# EAGLE schematic SparkFun_Pro_Micro_v13a (EAGLE 6.5.0)

## Sheet 1 of 5
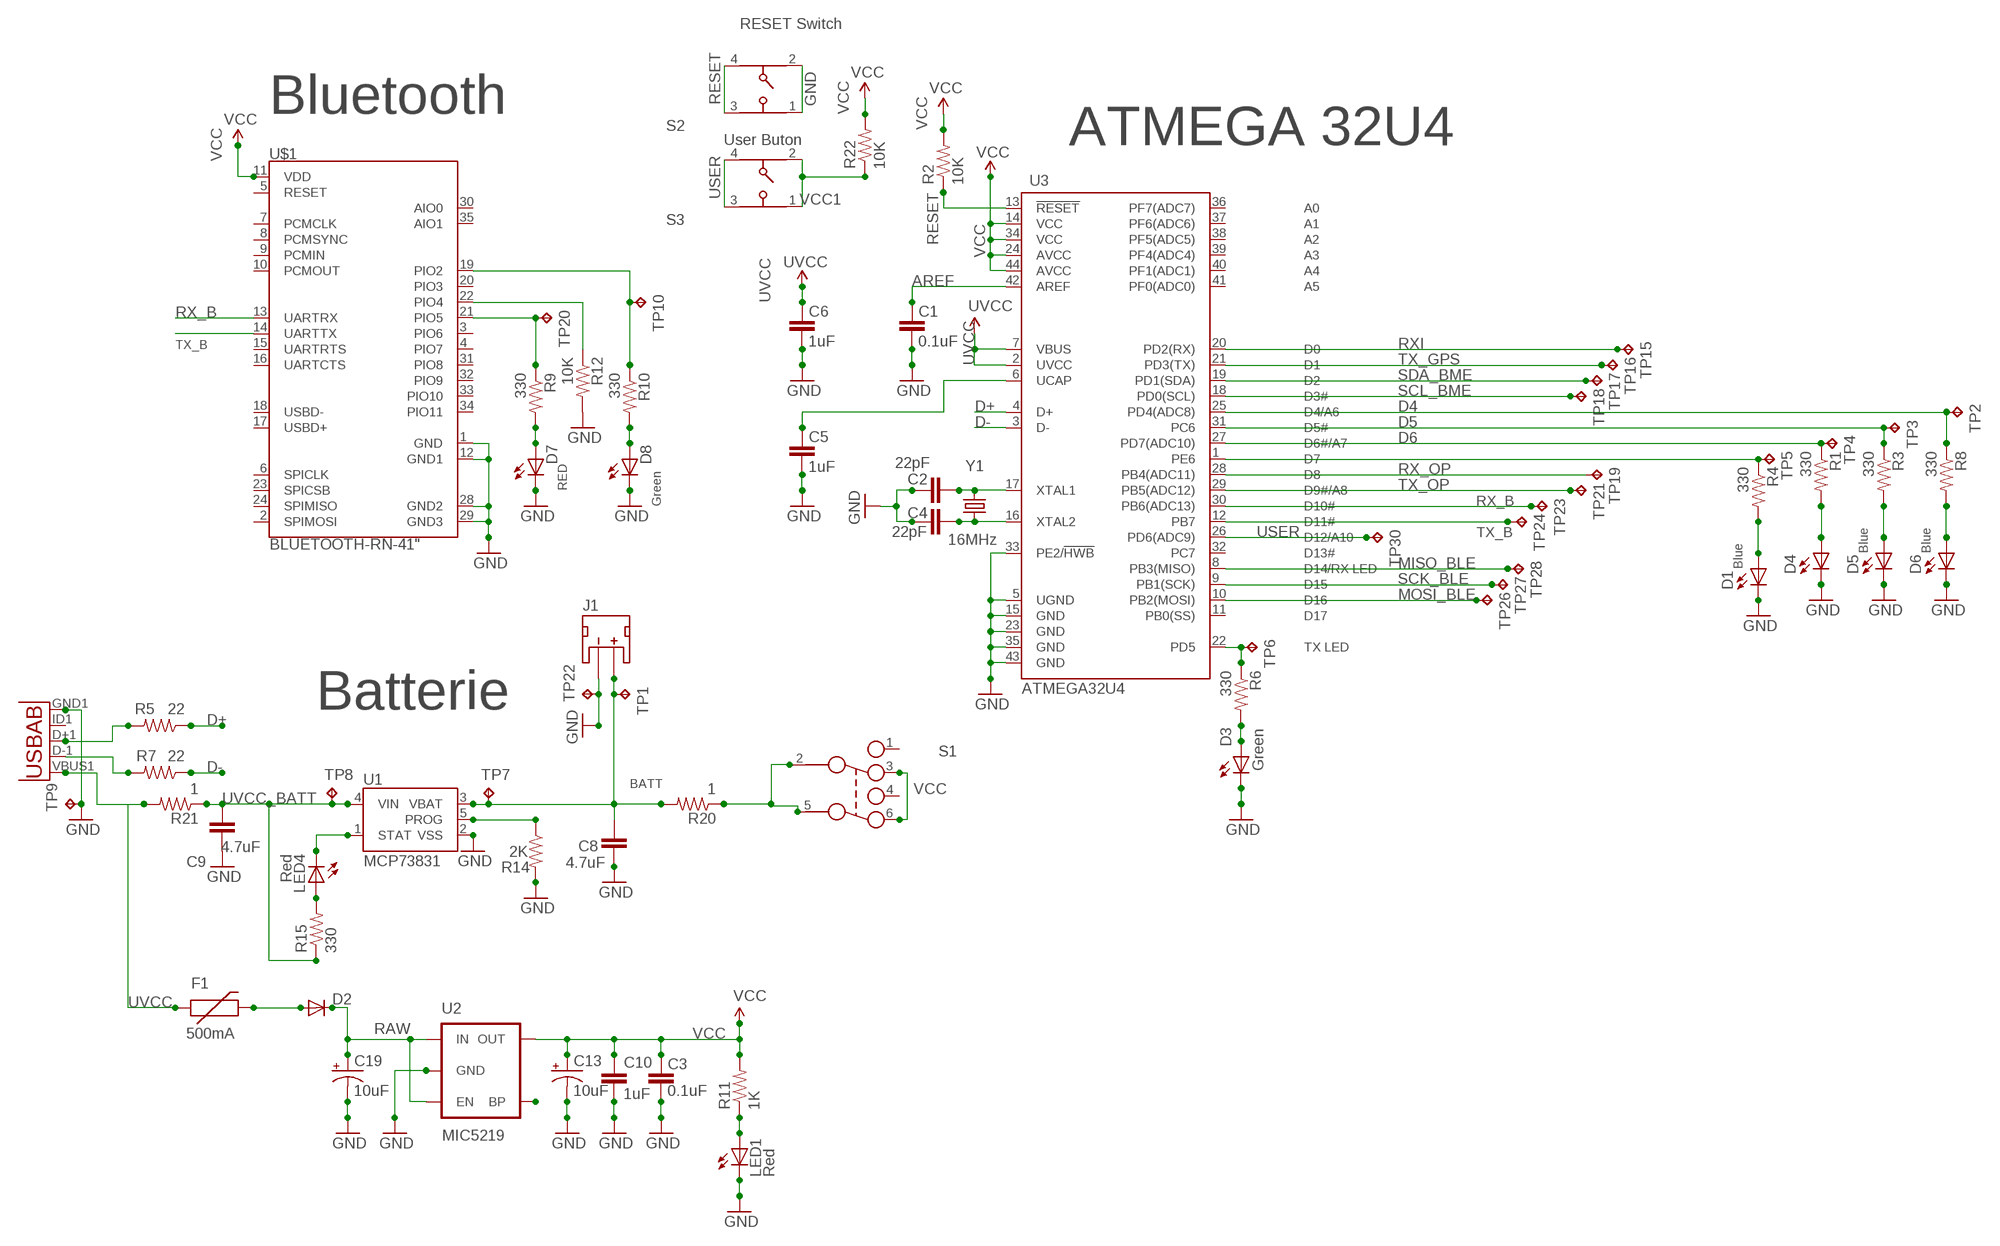
[diagram p0: schematic, sheet 1]

### Parts
C1  0.1uF  CAP0603-CAP  [0603-CAP]
C2  22pF  CAP0603-CAP  [0603-CAP]
C3  0.1uF  CAP0603-CAP  [0603-CAP]
C4  22pF  CAP0603-CAP  [0603-CAP]
C5  1uF  CAP0603-CAP  [0603-CAP]
C6  1uF  CAP0603-CAP  [0603-CAP]
C8  4.7uF  CAP0603-CAP  [0603-CAP]
C9  4.7uF  CAP0603-CAP  [0603-CAP]
C10  1uF  CAP0603-CAP  [0603-CAP]
C13  10uF  CAP_POL1206  [EIA3216]
C19  10uF  CAP_POL1206  [EIA3216]
D1  Yellow  LED0603  [LED-0603]
D2  DIODESOD  [SOD-323]
D3  Green  LED0603  [LED-0603]
D4  Yellow  LED0603  [LED-0603]
D5  Yellow  LED0603  [LED-0603]
D6  Yellow  LED0603  [LED-0603]
D7  Yellow  LED0603  [LED-0603]
D8  Yellow  LED0603  [LED-0603]
F1  500mA  PTCSMD  [PTC-1206]
J1  JST_2MM_MALE  [JST-2-SMD]
LED1  Red  LED0603  [LED-0603]
LED4  Red  LED0603  [LED-0603]
R1  330  RESISTOR0603-RES  [0603-RES]
R2  10K  RESISTOR0603-RES  [0603-RES]
R3  330  RESISTOR0603-RES  [0603-RES]
R4  330  RESISTOR0603-RES  [0603-RES]
R5  22  RESISTOR0603-RES  [0603-RES]
R6  330  RESISTOR0603-RES  [0603-RES]
R7  22  RESISTOR0603-RES  [0603-RES]
R8  330  RESISTOR0603-RES  [0603-RES]
R9  330  RESISTOR0603-RES  [0603-RES]
R10  330  RESISTOR0603-RES  [0603-RES]
R11  1K  RESISTOR0603-RES  [0603-RES]
R12  10K  RESISTOR0603-RES  [0603-RES]
R14  2K  RESISTOR0603-RES  [0603-RES]
R15  330  RESISTOR0603-RES  [0603-RES]
R20  1  RESISTOR0603-RES  [0603-RES]
R21  1  RESISTOR0603-RES  [0603-RES]
R22  10K  RESISTOR0603-RES  [0603-RES]
S1  452403012014  [452403012014]
S2  434153017835  [434153017835]
S3  434153017835  [434153017835]
TP1  TPTP08SQ  [TP08SQ]
TP2  TPTP08SQ  [TP08SQ]
TP3  TPTP08SQ  [TP08SQ]
TP4  TPTP08SQ  [TP08SQ]
TP5  TPTP08SQ  [TP08SQ]
TP6  TPTP08SQ  [TP08SQ]
TP7  TPTP08SQ  [TP08SQ]
TP8  TPTP08SQ  [TP08SQ]
TP9  TPTP17SQ  [TP17SQ]
TP10  TPTP08SQ  [TP08SQ]
TP15  TPTP08SQ  [TP08SQ]
TP16  TPTP08SQ  [TP08SQ]
TP17  TPTP08SQ  [TP08SQ]
TP18  TPTP08SQ  [TP08SQ]
TP19  TPTP08SQ  [TP08SQ]
TP20  TPTP08SQ  [TP08SQ]
TP21  TPTP08SQ  [TP08SQ]
TP22  TPTP08SQ  [TP08SQ]
TP23  TPTP20SQ  [TP20SQ]
TP24  TPTP20SQ  [TP20SQ]
TP26  TPTP08SQ  [TP08SQ]
TP27  TPTP08SQ  [TP08SQ]
TP28  TPTP08SQ  [TP08SQ]
TP30  TPTP08SQ  [TP08SQ]
U1  MCP73831  [SOT23-5]
U2  MIC5219  V_REG_LDOSMD  [SOT23-5]
U3  ATMEGA32U4  ATMEGA32U4OUTFAKES  [QFN-44-NOPAD_1:1-OUTFAKES]
U$1  BLUETOOTH-RN-41"  [RN41]
X1  USB-ABIN&OUT  [USB-AB-MICRO-SMD-V03-IN&OUT]
Y1  16MHz  CRYSTAL5X3  [CRYSTAL-SMD-5X3]

### Nets
AREF: C1.2 U3.42(AREF)
D1: R9.1 TP20.TP U$1.21(PIO5)
D2: R10.1 TP10.TP U$1.19(PIO2)
D4: R8.1 TP2.TP U3.25(PD4(ADC8))
D5: R3.1 TP3.TP U3.31(PC6)
D6: R1.1 TP4.TP U3.27(PD7(ADC10))
D14: R4.1 TP5.TP U3.1(PE6)
D+: R5.1 U3.4(D+)
D-: R7.1 U3.3(D-)
GND: C1.1 C2.2 C3.1 C4.2 C5.1 C6.1 C8.2 C9.2 C10.2 C13.C(-) C19.C(-) D1.C D3.C D4.C D5.C D6.C D7.C D8.C J1.1(-) LED1.C R12.2 R14.2 S2.1 S2.2 TP9.TP TP22.TP U1.2(VSS) U2.2(GND) U3.5(UGND) U3.15(GND) U3.23(GND) U3.33(PE2/!HWB) U3.35(GND) U3.43(GND) U$1.1(GND) U$1.12(GND1) U$1.28(GND2) U$1.29(GND3) X1.GND1(GND) ; also sheet 2,3,4,5
MISO_BLE: TP28.TP U3.8(PB3(MISO)) ; also sheet 3
MOSI_BLE: TP26.TP U3.10(PB2(MOSI)) ; also sheet 3
N$1: C4.1 U3.16(XTAL2) Y1.1
N$2: C2.1 U3.17(XTAL1) Y1.3
N$3: D2.2(A) F1.2
N$4: C5.2 U3.6(UCAP)
N$5: D1.A R4.2
N$6: R7.2 X1.D-1(D-)
N$7: D4.A R1.2
N$8: R5.2 X1.D+1(D+)
N$9: D5.A R3.2
N$10: D6.A R8.2
N$11: D3.A R6.2
N$12: R12.1 U$1.22(PIO4)
N$13: D7.A R9.2
N$14: D8.A R10.2
N$18: R14.1 U1.5(PROG)
N$19: LED4.A R15.2
N$20: LED4.C U1.1(STAT)
N$23: U2.4(BP)
N$38: LED1.A R11.1
N$70: R20.1 S1.2 S1.5
RAW [vcc]: C19.A(+) D2.1(C) U2.1(IN) U2.3(EN)
RESET: R2.1 S2.3 S2.4 U3.13(!RESET)
RX_B: TP23.TP U3.30(PB6(ADC13)) U$1.13(UARTRX)
RX_OP: TP19.TP U3.28(PB4(ADC11)) ; also sheet 5
RXI: TP15.TP U3.20(PD2(RX)) ; also sheet 5
SCK_BLE: TP27.TP U3.9(PB1(SCK)) ; also sheet 3
SCL_BME: TP18.TP U3.18(PD0(SCL)) ; also sheet 2
SDA_BME: TP17.TP U3.19(PD1(SDA)) ; also sheet 2
TX_B: TP24.TP U3.12(PB7) U$1.14(UARTTX)
TX_GPS: TP16.TP U3.21(PD3(TX)) ; also sheet 4
TX_OP: TP21.TP U3.29(PB5(ADC12)) ; also sheet 5
TXLED: R6.1 TP6.TP U3.22(PD5)
USER: S3.3 S3.4 TP30.TP U3.26(PD6(ADC9))
UVCC: C6.2 F1.1 R21.2 U3.2(UVCC) U3.7(VBUS) X1.VBUS1(VBUS)
UVCC_BATT: C9.1 R15.1 R21.1 TP8.TP U1.4(VIN)
VBATT: C8.1 J1.2(+) R20.2 TP1.TP TP7.TP U1.3(VBAT)
VCC: C3.2 C10.1 C13.A(+) R2.2 R11.2 R22.2 S1.3 S1.6 U2.5(OUT) U3.14(VCC) U3.24(AVCC) U3.34(VCC) U3.44(AVCC) U$1.11(VDD) ; also sheet 2,3,4,5
VCC1: R22.1 S3.1 S3.2
Unconnected: J1.NC1(PAD1) J1.NC2(PAD2) S1.1 S1.4 U3.11(PB0(SS)) U3.32(PC7) U3.36(PF7(ADC7)) U3.37(PF6(ADC6)) U3.38(PF5(ADC5)) U3.39(PF4(ADC4)) U3.40(PF1(ADC1)) U3.41(PF0(ADC0)) U$1.2(SPIMOSI) U$1.3(PIO6) U$1.4(PIO7) U$1.5(RESET) U$1.6(SPICLK) U$1.7(PCMCLK) U$1.8(PCMSYNC) U$1.9(PCMIN) U$1.10(PCMOUT) U$1.15(UARTRTS) U$1.16(UARTCTS) U$1.17(USBD+) U$1.18(USBD-) U$1.20(PIO3) U$1.23(SPICSB) U$1.24(SPIMISO) U$1.30(AIO0) U$1.31(PIO8) U$1.32(PIO9) U$1.33(PIO10) U$1.34(PIO11) U$1.35(AIO1) X1.ID1(USBID)

### Notes on the sheet
- RESET Switch
- Bluetooth
- User Buton | ATMEGA 32U4
- RED
- Green
- Blue | Blue
- Blue
- Batterie
- BATT

## Sheet 2 of 5
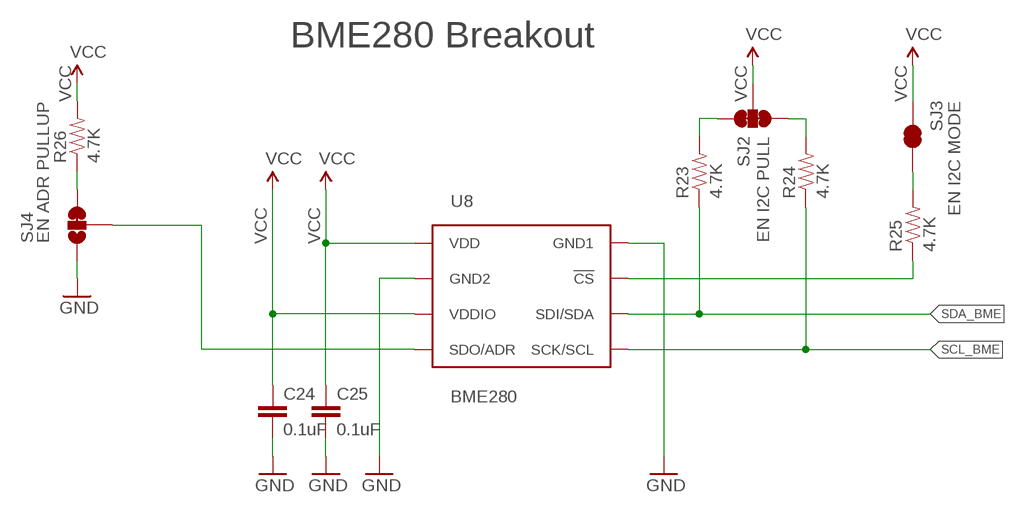
[diagram p1: schematic, sheet 2]

### Parts
C24  0.1uF  0.1UF-25V-5%(0603)  [0603-CAP@2]
C25  0.1uF  0.1UF-25V-5%(0603)  [0603-CAP@2]
R23  4.7K  4.7KOHM-1/10W-1%(0603)  [0603-RES@2]
R24  4.7K  4.7KOHM-1/10W-1%(0603)  [0603-RES@2]
R25  4.7K  4.7KOHM-1/10W-1%(0603)  [0603-RES@2]
R26  4.7K  4.7KOHM-1/10W-1%(0603)  [0603-RES@2]
SJ2  EN I2C PULL  JUMPER-PAD-3-NC_BY_TRACE  [PAD-JUMPER-3-3OF3_NC_BY_TRACE_YES_SILK_FULL_BOX]
SJ3  EN I2C MODE  JUMPER-PAD-2-NC_BY_TRACE  [PAD-JUMPER-2-NC_BY_TRACE_YES_SILK]
SJ4  EN ADR PULLUP  JUMPER-PAD-3-2OF3_NC_BY_TRACE_SMALL  [PAD-JUMPER-3-2OF3_NC_BY_TRACE_YES_SILK_FULL_BOX]
U8  BME280  [BME280_LGA]

### Nets
!CS: R25.1 U8.P$2(!CS)
GND: C24.2 C25.2 SJ4.1 U8.P$1(GND1) U8.P$7(GND2) ; also sheet 1,3,4,5
N$28: R23.2 SJ2.3
N$29: R24.2 SJ2.1
N$30: R25.2 SJ3.1
N$31: R26.1 SJ4.3
SCL_BME: R24.1 U8.P$4(SCK/SCL) ; also sheet 1
SDA_BME: R23.1 U8.P$3(SDI/SDA) ; also sheet 1
SDO/ADR: SJ4.2 U8.P$5(SDO/ADR)
VCC: C24.1 C25.1 R26.2 SJ2.2 SJ3.2 U8.P$6(VDDIO) U8.P$8(VDD) ; also sheet 1,3,4,5

### Notes on the sheet
- BME280 Breakout

## Sheet 3 of 5
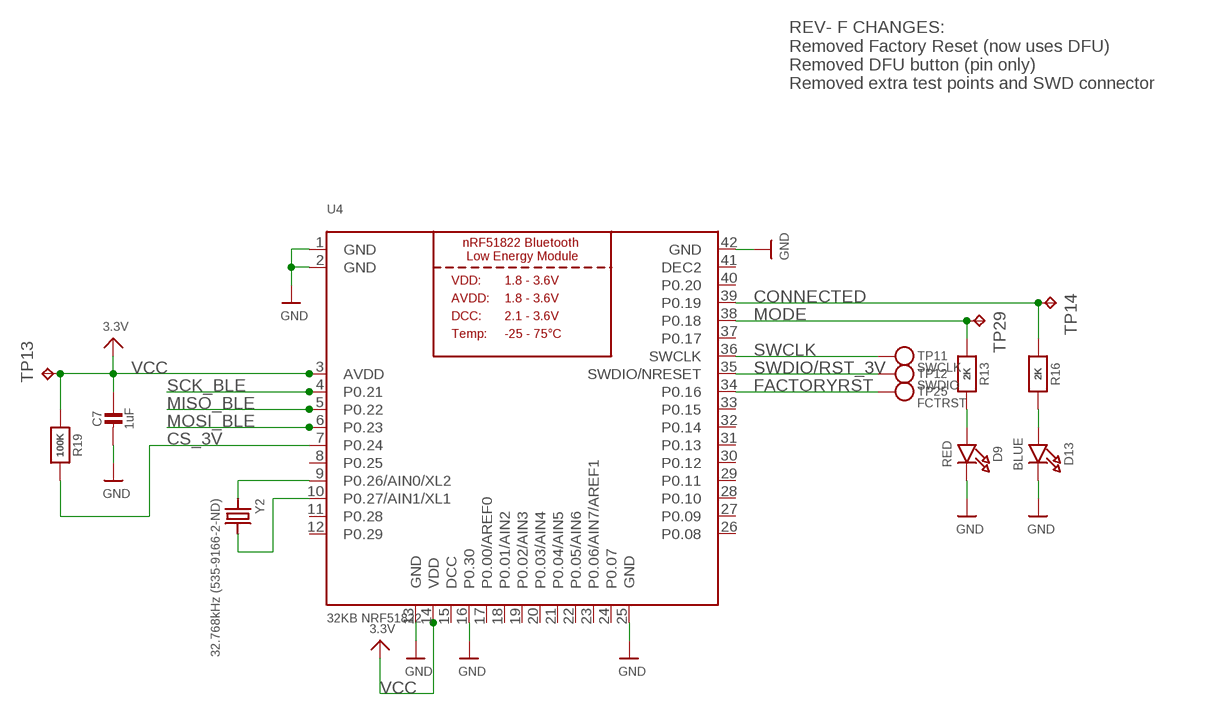
[diagram p2: schematic, sheet 3]

### Parts
C7  1uF  CAP_CERAMIC0805_10MGAP  [0805_10MGAP]
D9  RED  LED0805_NOOUTLINE  [CHIPLED_0805_NOOUTLINE]
D13  BLUE  LED0805_NOOUTLINE  [CHIPLED_0805_NOOUTLINE]
R13  2K  RESISTOR_0805MP  [_0805MP]
R16  2K  RESISTOR_0805MP  [_0805MP]
R19  100K  RESISTOR_0805MP  [_0805MP]
TP11  SWCLK  TESTPOINT1.5X2.0MM_NOCREAM  [PAD-1.5X2.0]
TP12  SWDIO  TESTPOINT1.5X2.0MM_NOCREAM  [PAD-1.5X2.0]
TP13  TPTP08SQ  [TP08SQ]
TP14  TPTP08SQ  [TP08SQ]
TP25  FCTRST  TESTPOINT1.5X2.0MM_NOCREAM  [PAD-1.5X2.0]
TP29  TPTP08SQ  [TP08SQ]
U4  32KB NRF51822  NRF51822_MODULE_MDBT40  [BLE_MODULE_RAYTAC_MDBT40]
Y2  32.768kHz (535-9166-2-ND)  CRYSTAL2.0X6.0_32.768  [CRYSTAL_CYL_2X6MM_SMT]

### Nets
CONNECTED: R16.1 TP14.TP U4.39(P0.19)
CS_3V: R19.2 U4.7(P0.24)
FACTORYRST: TP25.P$1 U4.34(P0.16)
GND: C7.2 D9.C D13.C U4.1(GND) U4.2(GND) U4.13(GND) U4.16(P0.30) U4.25(GND) U4.42(GND) ; also sheet 1,2,4,5
MISO_BLE: U4.5(P0.22) ; also sheet 1
MODE: R13.1 TP29.TP U4.38(P0.18)
MOSI_BLE: U4.6(P0.23) ; also sheet 1
N$15: D9.A R13.2
N$16: D13.A R16.2
N$17: U4.9(P0.26/AIN0/XL2) Y2.1
N$21: U4.10(P0.27/AIN1/XL1) Y2.2
SCK_BLE: U4.4(P0.21) ; also sheet 1
SWCLK: TP11.P$1 U4.36(SWCLK)
SWDIO/RST_3V: TP12.P$1 U4.35(SWDIO/NRESET)
VCC: C7.1 R19.1 TP13.TP U4.3(AVDD) U4.14(VDD) ; supply symbol labelled 3.3V ; also sheet 1,2,4,5
Unconnected: U4.8(P0.25) U4.11(P0.28) U4.12(P0.29) U4.17(P0.00/AREF0) U4.18(P0.01/AIN2) U4.19(P0.02/AIN3) U4.20(P0.03/AIN4) U4.21(P0.04/AIN5) U4.22(P0.05/AIN6) U4.23(P0.06/AIN7/AREF1) U4.24(P0.07) U4.26(P0.08) U4.27(P0.09) U4.28(P0.10) U4.29(P0.11) U4.30(P0.12) U4.31(P0.13) U4.32(P0.14) U4.33(P0.15) U4.37(P0.17) U4.40(P0.20)

### Notes on the sheet
- REV- F CHANGES:
  Removed Factory Reset (now uses DFU)
  Removed DFU button (pin only)
  Removed extra test points and SWD connector

## Sheet 4 of 5
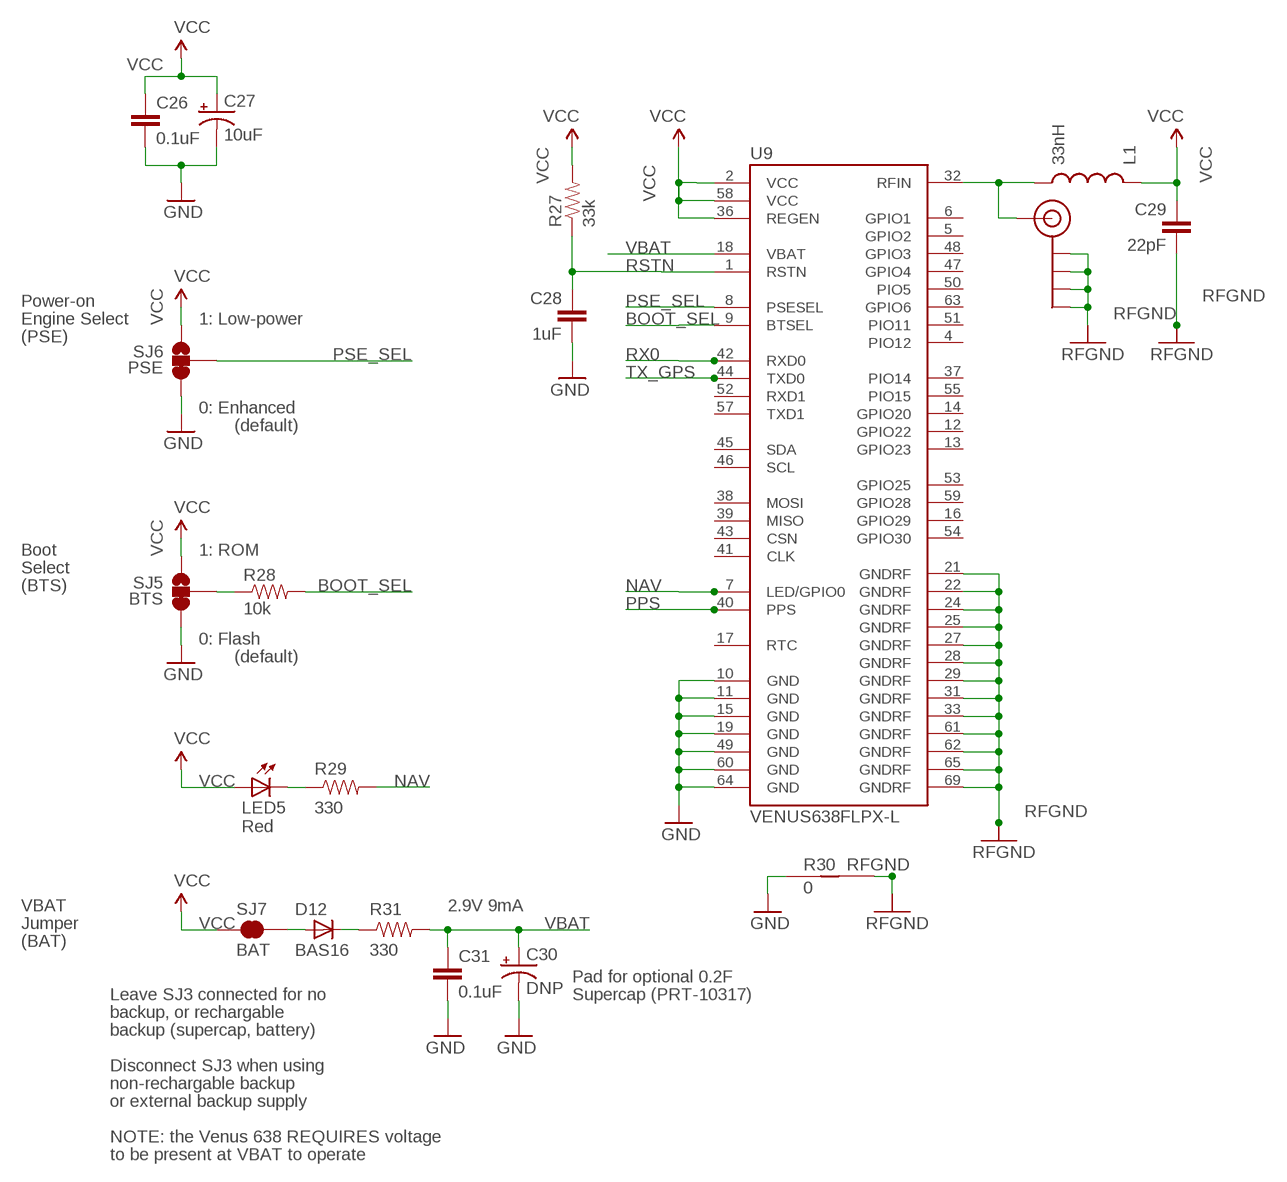
[diagram p3: schematic, sheet 4]

### Parts
C26  0.1uF  CAP0402-CAP  [0402-CAP]
C27  10uF  CAP_POL1206  [EIA3216]
C28  1uF  CAP0402-CAP  [0402-CAP]
C29  22pF  CAP0402-CAP  [0402-CAP]
C30  DNP  CAP_POLEN_J2  [EN_J2]
C31  0.1uF  CAP0402-CAP  [0402-CAP]
D12  BAS16  DIODESOD  [SOD-323]
JP10  SMA_EDGE  [SMA-EDGE]
L1  33nH  INDUCTOR0402  [C0402]
LED5  Red  LED0603  [LED-0603]
R27  33k  RESISTOR0402-RES  [0402-RES]
R28  10k  RESISTOR0402-RES  [0402-RES]
R29  330  RESISTOR0402-RES  [0402-RES]
R30  0  GND-JUMP  [GND-JUMP]
R31  330  RESISTOR0402-RES  [0402-RES]
SJ5  BTS  SOLDERJUMPER_2WAYPASTE2&3  [SJ_3_PASTE2&3]
SJ6  PSE  SOLDERJUMPER_2WAYPASTE2&3  [SJ_3_PASTE2&3]
SJ7  BAT  SOLDERJUMPERNC  [SJ_2S]
U9  VENUS638FLPX-L  [VENUS638FLPX]

### Nets
ANT: JP10.SIG(SIGNAL) L1.2 U9.32(RFIN)
BOOT_SEL: R28.2 U9.9(BTSEL)
GND: C26.2 C27.C(-) C28.2 C30.- C31.2 R30.1 SJ5.3 SJ6.3 U9.10(GND) U9.11(GND) U9.15(GND) U9.19(GND) U9.49(GND) U9.60(GND) U9.64(GND) ; also sheet 1,2,3,5
N$34: LED5.C R29.1
N$35: R28.1 SJ5.2
N$36: D12.2(A) SJ7.2
N$37: D12.1(C) R31.1
NAV: R29.2 U9.7(LED/GPIO0)
PPS: U9.40(PPS)
PSE_SEL: SJ6.2 U9.8(PSESEL)
RFGND: C29.2 JP10.GND@0(GND) JP10.GND@1(GND) JP10.GND@2(GND) JP10.GND@3(GND) R30.2 U9.21(GNDRF) U9.22(GNDRF) U9.24(GNDRF) U9.25(GNDRF) U9.27(GNDRF) U9.28(GNDRF) U9.29(GNDRF) U9.31(GNDRF) U9.33(GNDRF) U9.61(GNDRF) U9.62(GNDRF) U9.65(GNDRF) U9.69(GNDRF)
RSTN: C28.1 R27.1 U9.1(RSTN)
RX0: U9.42(RXD0)
TX_GPS: U9.44(TXD0) ; also sheet 1
VBAT: C30.+ C31.1 R31.2 U9.18(VBAT)
VCC: C26.1 C27.A(+) C29.1 L1.1 LED5.A R27.2 SJ5.1 SJ6.1 SJ7.1 U9.2(VCC) U9.36(REGEN) U9.58(VCC) ; also sheet 1,2,3,5
Unconnected: U9.4(PIO12) U9.5(GPIO2) U9.6(GPIO1) U9.12(GPIO22) U9.13(GPIO23) U9.14(GPIO20) U9.16(GPIO29) U9.17(RTC) U9.37(PIO14) U9.38(MOSI) U9.39(MISO) U9.41(CLK) U9.43(CSN) U9.45(SDA) U9.46(SCL) U9.47(GPIO4) U9.48(GPIO3) U9.50(PIO5) U9.51(PIO11) U9.52(RXD1) U9.53(GPIO25) U9.54(GPIO30) U9.55(PIO15) U9.57(TXD1) U9.59(GPIO28) U9.63(GPIO6)

### Notes on the sheet
- Power-on
- Engine Select | 1: Low-power
- (PSE)
- RFGND | RFGND
- 0: Enhanced
- (default)
- Boot | 1: ROM
- Select
- (BTS)
- 0: Flash
- (default)
- RFGND
- VBAT | 2.9V 9mA
- Jumper | RFGND
- (BAT)
- Pad for optional 0.2F
- Leave SJ3 connected for no | Supercap (PRT-10317)
- backup, or rechargable
- backup (supercap, battery)
- Disconnect SJ3 when using
- non-rechargable backup
- or external backup supply
- NOTE: the Venus 638 REQUIRES voltage
- to be present at VBAT to operate

## Sheet 5 of 5
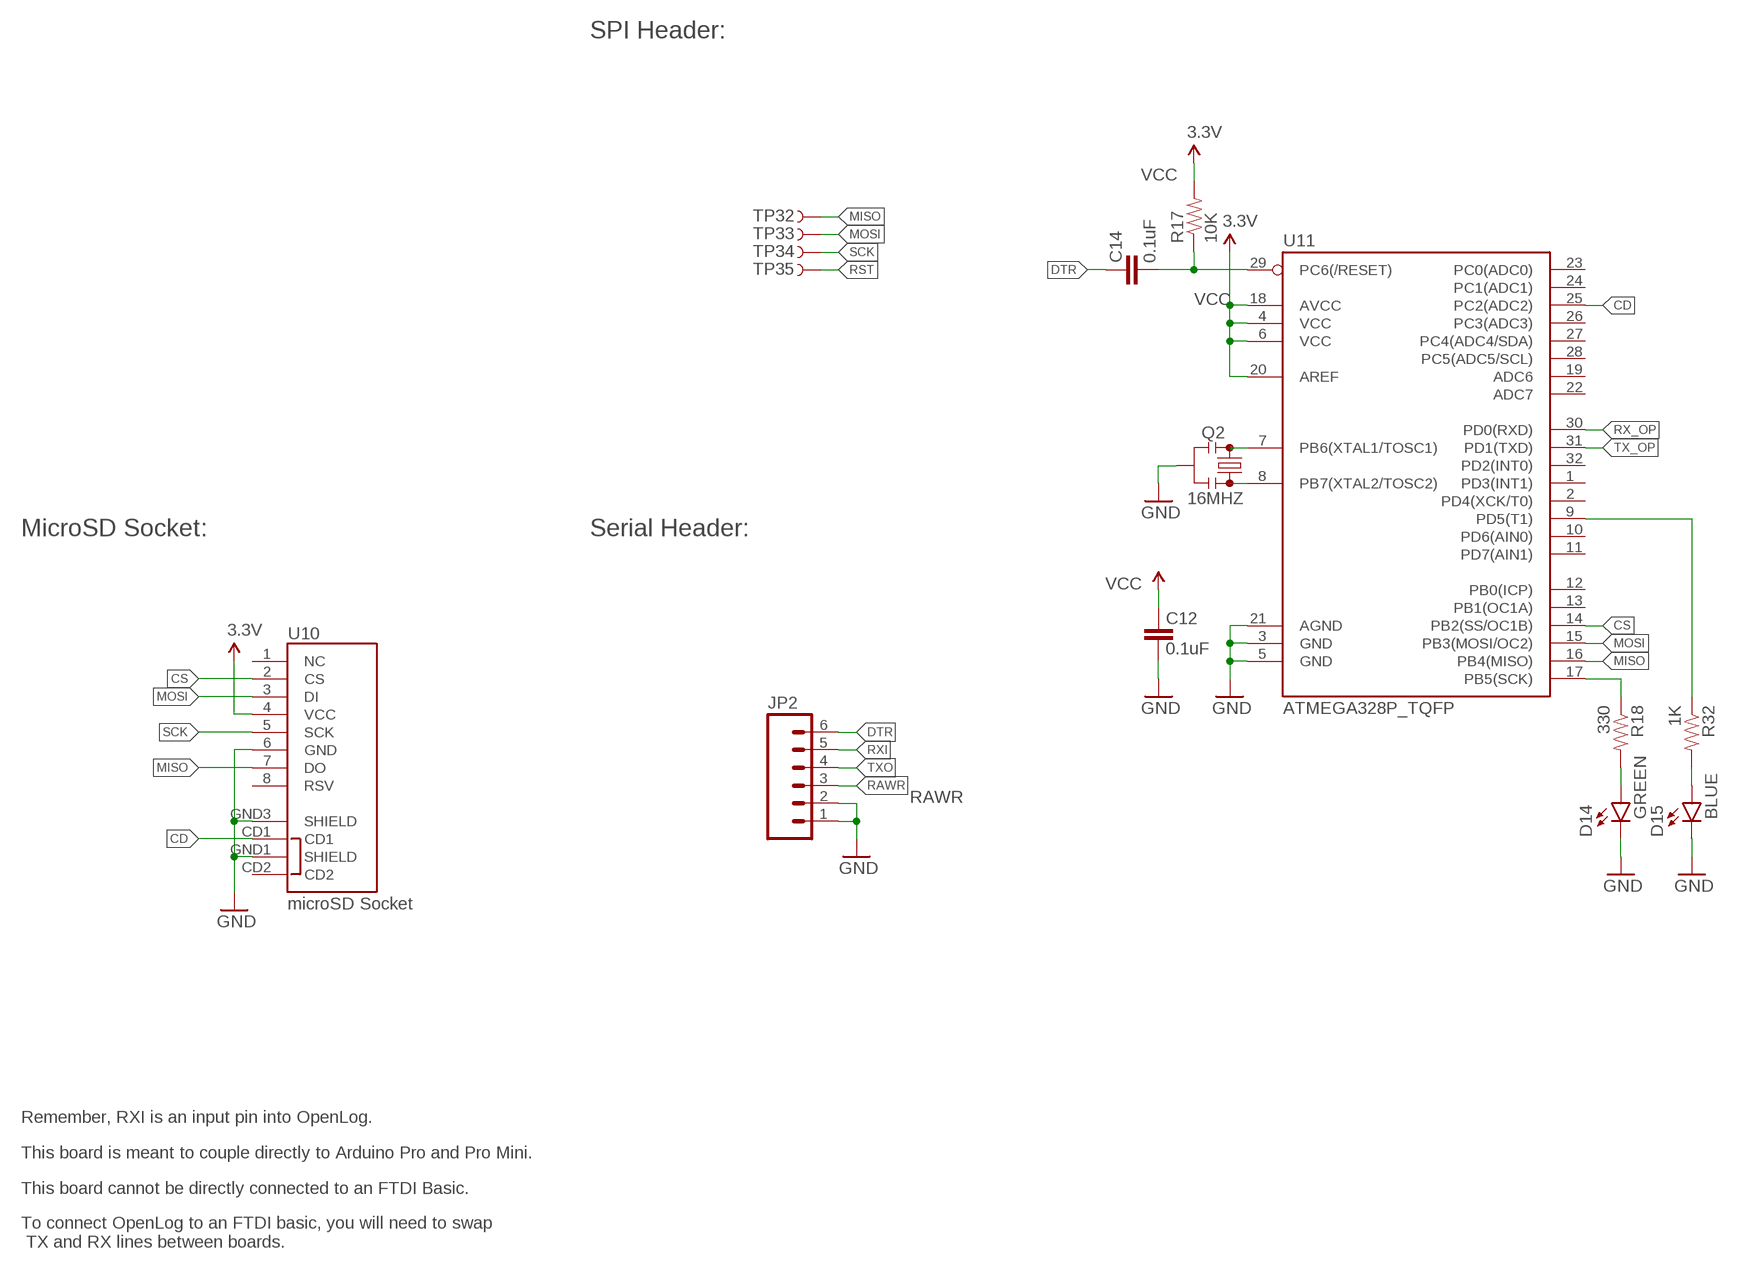
[diagram p4: schematic, sheet 5]

### Parts
C12  0.1uF  0.1UF-25V(+80/-20%)(0603)  [0603-CAP]
C14  0.1uF  0.1UF-25V(+80/-20%)(0603)  [0603-CAP]
D14  GREEN  LED-GREEN0603  [LED-0603]
D15  BLUE  LED-BLUE0603  [LED-0603]
JP2  M06NO_SILK_FEMALE_PTH  [1X06_NO_SILK]
Q2  16MHZ  RESONATOR16MHZ  [RESONATOR-SMD]
R17  10K  10KOHM-1/10W-1%(0603)0603  [0603-RES]
R18  330  330OHM1/10W1%(0603)  [0603-RES]
R32  1K  1KOHM-1/10W-1%(0603)  [0603-RES]
TP32  TEST-POINT3  [PAD.03X.03]
TP33  TEST-POINT3  [PAD.03X.03]
TP34  TEST-POINT3  [PAD.03X.03]
TP35  TEST-POINT3  [PAD.03X.03]
U10  microSD Socket  USD-SOCKET  [MICROSD_1:1]
U11  ATMEGA328P_TQFP  [TQFP32-08]

### Nets
3.3V: U10.4(VCC)
CD: U10.CD1 U11.25(PC2(ADC2))
CS: U10.2(CS) U11.14(PB2(SS/OC1B))
DTR: C14.2 JP2.6
GND: C12.1 D14.C D15.C JP2.1 JP2.2 Q2.2 U10.6(GND) U10.GND1(SHIELD) U10.GND3(SHIELD) U11.3(GND) U11.5(GND) U11.21(AGND) ; also sheet 1,2,3,4
MISO: TP32.P$1 U10.7(DO) U11.16(PB4(MISO))
MOSI: TP33.P$1 U10.3(DI) U11.15(PB3(MOSI/OC2))
N$22: D14.A R18.2
N$32: Q2.1 U11.8(PB7(XTAL2/TOSC2))
N$33: Q2.3 U11.7(PB6(XTAL1/TOSC1))
N$39: D15.A R32.2
N$40: R32.1 U11.9(PD5(T1))
RAWR [vcc]: JP2.3
RST: C14.1 R17.1 TP35.P$1 U11.29(PC6(/RESET))
RX_OP: U11.30(PD0(RXD)) ; also sheet 1
RXI: JP2.5 ; also sheet 1
SCK: R18.1 TP34.P$1 U10.5(SCK) U11.17(PB5(SCK))
TX_OP: U11.31(PD1(TXD)) ; also sheet 1
TXO: JP2.4
VCC: C12.2 R17.2 U11.4(VCC) U11.6(VCC) U11.18(AVCC) U11.20(AREF) ; supply symbol labelled 3.3V ; also sheet 1,2,3,4
Unconnected: U10.1(NC) U10.8(RSV) U10.CD2 U11.1(PD3(INT1)) U11.2(PD4(XCK/T0)) U11.10(PD6(AIN0)) U11.11(PD7(AIN1)) U11.12(PB0(ICP)) U11.13(PB1(OC1A)) U11.19(ADC6) U11.22(ADC7) U11.23(PC0(ADC0)) U11.24(PC1(ADC1)) U11.26(PC3(ADC3)) U11.27(PC4(ADC4/SDA)) U11.28(PC5(ADC5/SCL)) U11.32(PD2(INT0))

### Notes on the sheet
- SPI Header:
- MicroSD Socket: | Serial Header:
- Remember, RXI is an input pin into OpenLog.
- This board is meant to couple directly to Arduino Pro and Pro Mini.
- This board cannot be directly connected to an FTDI Basic.
- To connect OpenLog to an FTDI basic, you will need to swap
   TX and RX lines between boards.

## Power pins joined to a net without a drawn wire
DCC: U4.15(DCC)
DEC2: U4.41(DEC2)

## Library data of the parts
C1-C6 C8-C10 C26 C28 C29 C31 = SparkFun:CAP: Capacitor Standard 0603 ceramic capacitor, and 0.1" leaded capacitor.
C7 = microbuilder:CAP_CERAMIC: Ceramic Capacitors For new designs, use the packages preceded by an '_' character since they are more reliable: The following footprints should be used on most boards: _0402 - Standard footprint for regular board layouts _0603 - Standard footprint for regular board layouts _0805 - Standard footprint for regular board layouts _1206 - Standard footprint for regular board layouts For extremely tight-pitch boards where space is at a premium, the following 'micro-pitch' footprints can be used (smaller pads, no silkscreen outline, etc.): _0402MP - Micro-pitch footprint for very dense/compact boards _0603MP - Micro-pitch footprint for very dense/compact boards _0805MP - Micro-pitch footprint for very dense/compact boards _1206MP - Micro-pitch footprint for very dense/compact boards
C12 C14 = SparkFun-Capacitors:0.1UF-25V(+80/-20%)(0603): CAP-00810 Ceramic Standard decoupling cap; PROD_ID: CAP-00810
C13 C19 C27 C30 = SparkFun:CAP_POL: Capacitor Polarized These are standard SMD and PTH capacitors. Normally 10uF, 47uF, and 100uF in electrolytic and tantalum varieties. Always verify the external diameter of the through hole cap, it varies with capacity, voltage, and manufacturer. The EIA devices should be standard.
C24 C25 = SparkFun-Capacitors:0.1UF-25V-5%(0603): CAP-08604; PROD_ID: CAP-08604
D1 D3-D8 LED1 LED4 LED5 = SparkFun:LED: LEDs Standard schematic elements and footprints for 5mm, 3mm, 1206, and 0603 sized LEDs. 5mm - Spark Fun Electronics SKU : COM-00529 (and others)
D2 D12 = SparkFun:DIODE: Diode These are standard reverse protection diodes and small signal diodes. SMA package can handle up to about 1A. SOD-323 can handle about 200mA. What the SOD-323 package when ordering, there are some mfgs out there that are 5-pin packages.
D9 D13 = microbuilder:LED: LED 0603 - 0603 Surface Mount Package 2mA: Green LED - Low Power (3.9mcd, 2ma, 1.7Vf) - Digikey: 475-2709-2-ND Orange LED - Low Power (9.8mcd, 2ma, 1.8Vf) - Digikey: 475-1194-2-ND Red LED - Low Power (5mcd, 2ma, 1.8Vf) - Digikey: 475-1195-2-ND Yellow LED - Low Power (7mcd, 2ma, 1.8Vf) - Digikey: 475-1196-2-ND 5mA: Blue LED - Low Power (17mcd, 5ma, 2.9Vf) - Digikey: LNJ937W8CRACT-ND 0805 - 0805 Surface Mount Package 2mA: Red LED (8.8mcd, 2mA, 1.8Vf, Clear) - Low Power [Digikey: 475-2510-1-ND] Green LED (5mcd, 2mA, 1.8Vf, Clear) - Low Power [Digikey: 475-2730-1-ND] Yellow LED (11.3mcd, 2mA, 1.8Vf, Clear) - Low Power [Digikey: 475-2555-1-ND] 20mA: Red LED (104mcd, 20mA, Diffused) - LS R976 [Digikey: 475-1278-6-ND] Red LED (12mcd, 20mA, 2.0Vf, Clear) - APT2012EC [Digikey: 754-1128-1-ND] Green LED (15mcd, 20mA, 2.2Vf, Clear) - APT2012GC [Digikey: 754-1131-1-ND] Orange LED (160mcd, 20mA, 2.1Vf, Clear) - APT2012SECK [Digikey: 754-1130-1-ND] 1206 - 1206 Surface Mount Package Green LED (26mcd, 20mA, Diffused) - LG N971 [Digikey: 475-1407-6-ND] Red LED (15mcd, 20mA, Diffused) - LH N974 [Digikey: 475-1416-6-ND] Cree - Cree High-Power Surface Mount LEDs XPEBWT-L1-0000-00D50 - White 111lm 350mA 2.9Vf 6200K 110° XTEAWT-00-0000-00000LEE3 - White 114lm 350mA 2.85Vf 5000K 115° Everlight - Everlight 45-21 Series Surface Mount LEDs 45-21/QK2C-B2832AC2CB2/2T - Warm White 2000mcd 20mA 3.25Vf 3050K 120° 45-21/LK2C-B38452C4CB2/2T - Nuetral White 2000mcd 20mA 3.25Vf 4150K 120° 45-21/LK2C-B50634C6CB2/2T - Cold White 2200mcd 20mA 3.25Vf 5650K 120° PLCC2 Reverse Mount LS T77K-J1L2-1-0-2-R18-Z - Red 11.25mcd 2mA 1.8Vf 630nm 120° LO T77K-L1M2-24-Z - Orange 19.6mcd 2mA 1.8Vf 606nm 120° LY T77K-K2M1-26-Z - Yellow 15.7mcd 2mA 1.8Vf 587nm 120°
D14 = SparkFun-LED:LED-GREEN: Various green LEDs Green LEDs used in SFE Production 0603- DIO-00821 LARGE- DIO-00862 LILYPAD- DIO-09910; PROD_ID: DIO-00821
D15 = SparkFun-LED:LED-BLUE: Blue LEDs for production use Various blue LEDs stocked by SparkFun production 0603 - DIO-08575 Rebel - DIO-09553 1206 - DIO-09911; PROD_ID: DIO-08575
F1 = SparkFun:PTC: Resettable Fuse PTC Resettable Fuse. Spark Fun Electronics SKU : COM-08357
J1 = SparkFun-Connectors:JST_2MM_MALE: JST 2MM MALE RA CONNECTOR Two pin, compact surface mount connector. Commonly used as a battery input connection point. We really like the solid locking feeling and high current rating on these small connectors. We use these all the time as battery connectors. Mates to single-cell LiPo batteries. Here is the connector we sell at SparkFun: JST Right Angle Connector - White <https://www.sparkfun.com/products/8612> (PRT-08612) Datasheet <http://www.sparkfun.com/datasheets/Prototyping/Connectors/JST-Horizontal.pdf> It was used on these SparkFun products: SparkFun MOSFET Power Controller <https://www.sparkfun.com/products/11214> (PRT-11214) SparkFun Battery Babysitter - LiPo Battery Manager <https://www.sparkfun.com/products/13777> (PRT-13777) And many, many others that required a lipo battery connection.; PROD_ID: CONN-11443; SF_ID: PRT-08612
JP2 = SparkFun-Connectors:M06: Header 6 Standard 6-pin 0.1" header. Use with straight break away headers (SKU : PRT-00116), right angle break away headers (PRT-00553), swiss pins (PRT-00743), machine pins (PRT-00117), and female headers (PRT-00115). Molex polarized connector foot print use with SKU : PRT-08094 with associated crimp pins and housings. NOTES ON THE VARIANTS LOCK and LOCK_LONGPADS... This footprint was designed to help hold the alignment of a through-hole component (i.e. 6-pin header) while soldering it into place. You may notice that each hole has been shifted either up or down by 0.005 of an inch from it's more standard position (which is a perfectly straight line). This slight alteration caused the pins (the squares in the middle) to touch the edges of the holes. Because they are alternating, it causes a "brace" to hold the component in place. 0.005 has proven to be the perfect amount of "off-center" position when using our standard breakaway headers. Although looks a little odd when you look at the bare footprint, once you have a header in there, the alteration is very hard to notice. Also,if you push a header all the way into place, it is covered up entirely on the bottom side. This idea of altering the position of holes to aid alignment will be further integrated into the Sparkfun Library for other footprints. It can help hold any component with 3 or more connection pins.; PROD_ID: CONN-08437
JP10 = SparkFun:SMA_EDGE: SMA Antenna Connector End launch SMA connector. The paste layer has been removed so that the connector can be hand soldered onto the board after reflow.
L1 = SparkFun:INDUCTOR: Inductors Basic Inductor/Choke - 0603 and 1206. Footprints are not proven and vary greatly between part numbers.
Q2 = SparkFun-FreqCtrl:RESONATOR: Resonator Small SMD resonator. Used, eg, on the Arduino Pro/ Pro Mini boards. 8MHz- XTAL-08895 16MHz- XTAL-08900; PROD_ID: XTAL-08900
R1-R12 R14 R15 R20-R22 R27-R29 R31 = SparkFun:RESISTOR: Resistor Basic schematic elements and footprints for 0603, 1206, and PTH resistors.
R13 R16 R19 = microbuilder:RESISTOR: Resistors For new designs, use the packages preceded by an '_' character since they are more reliable: The following footprints should be used on most boards: _0402 - Standard footprint for regular board layouts _0603 - Standard footprint for regular board layouts _0805 - Standard footprint for regular board layouts _1206 - Standard footprint for regular board layouts For extremely tight-pitch boards where space is at a premium, the following 'micro-pitch' footprints can be used (smaller pads, no silkscreen outline, etc.): _0402MP - Micro-pitch footprint for very dense/compact boards _0603MP - Micro-pitch footprint for very dense/compact boards _0805MP - Micro-pitch footprint for very dense/compact boards _1206MP - Micro-pitch footprint for very dense/compact boards
R17 = SparkFun-Resistors:10KOHM-1/10W-1%(0603): RES-00824; PROD_ID: RES-00824
R18 = SparkFun-Resistors:330OHM1/10W1%(0603): RES-00818; PROD_ID: RES-00818
R23-R26 = SparkFun-Resistors:4.7KOHM-1/10W-1%(0603): RES-07857; PROD_ID: RES-07857
R30 = mike-temp:GND-JUMP: Zero-Ohm trace for connecting different ground planes at a single point.
R32 = SparkFun-Resistors:1KOHM-1/10W-1%(0603): RES-07856; PROD_ID: RES-07856
S1 = Switches_rev16a:452403012014: WS-SLSV Slide Switch, SMD version, same side connection Specification Rating : 300mA, 6VDC Contact Resistance Initial: 50mΩ max. After life test: 200mΩ max. Insulation Resistance: min.100MΩ at 500VDC Dielectric Strength : 500VAC for 1 minute Total-Travel : 2.0±0.2mm Operation Force :200 ±150g Life cycle : :20,000 steps Switch function :ON-ON Material Cover : : Stainless steel Base :PA9T UL 94 V-0, color Black. Actuator :LCP UL 94 V-0, color Black Contact : :Copper Alloy with Silver Terminal : Copper Alloy with Silver <http://katalog.we-online.de/media/images/v2/Family_WS-SLSV_452403012014.jpg> Details see: http://katalog.we-online.de/en/em/SLSV_7_65X_5_5_SMD_VERTICAL?sid=d553d9ab8e 2015 (C) Würth Elektronik
S2 S3 = Switches_rev16a:434153017835: WS-TASV Tact Switch J-Bend SMD version Specification Rating : 50mA, 12VDC Contact Resistance Initial: 100mΩ max. After life test:1mΩ max. Insulation Resistance: min.100MΩ at 500VDC Dielectric Strength : 250VAC for 1 minute Stroke:0.15±0.1mm Bounce :10ms max. Material Cover : : Stainless steel Stem :LCP UL 94 V-0. FramePA46 UL HB, color Black >Contact : Stainless Steel with Silver Tape:Polyimide tape Terminal : Copper Alloy with Silver <http://katalog.we-online.de/media/images/v2/WS-TASU_434331013822_a_4C.jpg> Details see: http://katalog.we-online.de/en/em/TASV_3_5X2_9_SMD_J-BEND?sid=d553d9ab8e 2015 (C) Würth Elektronik
SJ2 = SparkFun-Passives:JUMPER-PAD-3-NC_BY_TRACE
SJ3 = SparkFun-Passives:JUMPER-PAD-2-NC_BY_TRACE
SJ4 = SparkFun-Passives:JUMPER-PAD-3-2OF3_NC_BY_TRACE
SJ5 SJ6 = SparkFun:SOLDERJUMPER_2WAY: Solder Jumper 2 way solder jumper
SJ7 = SparkFun:SOLDERJUMPER: Solder Jumper Standard SMD solder jumper. Used to automate production. Two varients : Normally Open and Normally Closed are the same, but have different paste layers. NC will have a large amount of paste and should jumper during reflow.
TP1-TP10 TP15-TP22 TP26-TP28 TP30 = testpad:TP: Test pad
TP11 TP12 TP25 = microbuilder:TESTPOINT: Test Point Various test points for characterisation and PCB testing TESTPOINT_SMT - Compact Surface Mount Test Point [Digikey: 5016KTR-ND]
TP13 TP14 TP23 TP24 TP29 = isenproject:TP: Test pad
TP32-TP35 = SparkFun-Passives:TEST-POINT: Bare copper test points for troubleshooting or ICT
U1 = SparkFun-PowerIC:MCP73831: Miniature single cell, fully integrated Li-Ion, Li-polymer charge management controller http://ww1.microchip.com/downloads/en/DeviceDoc/20001984g.pdf IC-09995; PROD_ID: IC-09995
U2 = SparkFun:V_REG_LDO: Voltage Regulator LDO Standard 150mA LDO voltage regulator in SOT-23 layout. Micrel part MIC5205. BP (by-pass) pin is used to lower output noise with 470pF cap.
U3 = Testing:ATMEGA32U4: Atmel 44-pin 8-bit Microcontroller with 32KBytes of ISP Flash and USB Controller
U4 = microbuilder:NRF51822_MODULE_MDBT40: nRF51822 Bluetooth Low Energy Module
U8 = BME280ComponentLibrary:BME280; PROD_ID: IC-13090
U9 = mike-temp:VENUS638FLPX-L: Venus638FLPX-L GPS Receiver Venus638FLPx is a high performance, low cost, single chip GPS receiver targeting mobile consumer and cellular handset applications. It offers very low power consumption, high sensitivity, and best in class signal acquisition and time-to-first-fix performance. Venus638FLPx contains all the necessary components of a complete GPS receiver, includes 1.2dB cascaded system NF RF front-end, GPS baseband signal processor, 0.5ppm TCXO, 32.768kHz RTC crystal, RTC LDO regulator, and passive components. It requires very low external component count and takes up only 100mm2 PCB footprint. Dedicated massive-correlator signal parameter search engine within the baseband enables rapid search of all the available satellites and acquisition of very weak signal. An advanced track engine allows weak signal tracking and positioning in harsh environments such as urban canyons and under deep foliage. The self-contained architecture keeps GPS processing off the host and allows integration into applications with very little resource. FEATURES 20Hz update rate -148dBm cold start sensitivity -165dBm tracking sensitivity 29 second cold start TTFF 3.5 second TTFF with AGPS 1 second hot start 2.5m accuracy Multipath detection and suppression Jamming detection and mitigation SBAS (WAAS / EGNOS) support 7-day extended ephemeris AGPS 67mW full power navigation Works directly with active or passive antenna Internal flash for optional 75K point data logging Supports external SPI flash memory data logging Complete receiver in 10mm x 10mm x 1.3mm size Contains LNA, SAW Filter, TCXO, RTC Xtal, LDO Pb-free RoHS compliant
U10 = SparkFun-Connectors:USD-SOCKET: microSD Socket Push-push type uSD socket. Schematic element and footprint production proven. Spark Fun Electronics SKU : PRT-00127. tDoc lines correctly indicate media card edge positions when inserting (unlocked, locked, depressed). NOTE: CD1 and CD2 are connected internally; PROD_ID: CONN-07820
U11 = SparkFun-DigitalIC:ATMEGA328P_TQFP; PROD_ID: IC-09069
U$1 = SparkFun-RF:BLUETOOTH-RN-41: Roving Networks RN-41 Bluetooth Module The RN-41 module is a small form factor, low power, class 1 Bluetooth radio that is ideal for designers who want to add wireless capability to their products without spending significant time and money developing Bluetooth-specific hardware and software. The RN-41 supports multiple interface protocols, is simple to design in, and is fully certified, making it a complete embedded Bluetooth solution. SparkFun Products: Bluetooth SMD Module - RN-41 <https://www.sparkfun.com/products/12575> (WRL-12575) Bluetooth Module Breakout - Roving Networks (RN-41 v6.15) <https://www.sparkfun.com/products/12579> (WRL-12579); PROD_ID: IC-11844; SF_ID: WRL-12575
X1 = Testing:USB-AB: This is a USB AB connector that is compatible with USB OTG. i.e. this connector can serve as a host or device
Y1 = SparkFun:CRYSTAL: Crystals
Y2 = microbuilder:CRYSTAL: Crystals

## Net classes
0 default: width 0.203 mm